# Altium schematic sheet DebugBreakout_RevD.SchDoc: Debug Breakout Board
size A3; Organization: INTERCREATE; Address1: 2415 3RD ST. SUITE #232; Address2: SAN FRANCISCO CA 94107; Revision: D; SheetNumber: 1; SheetTotal: 1; ProjectName: KAGWERKS COMMAND CENTER
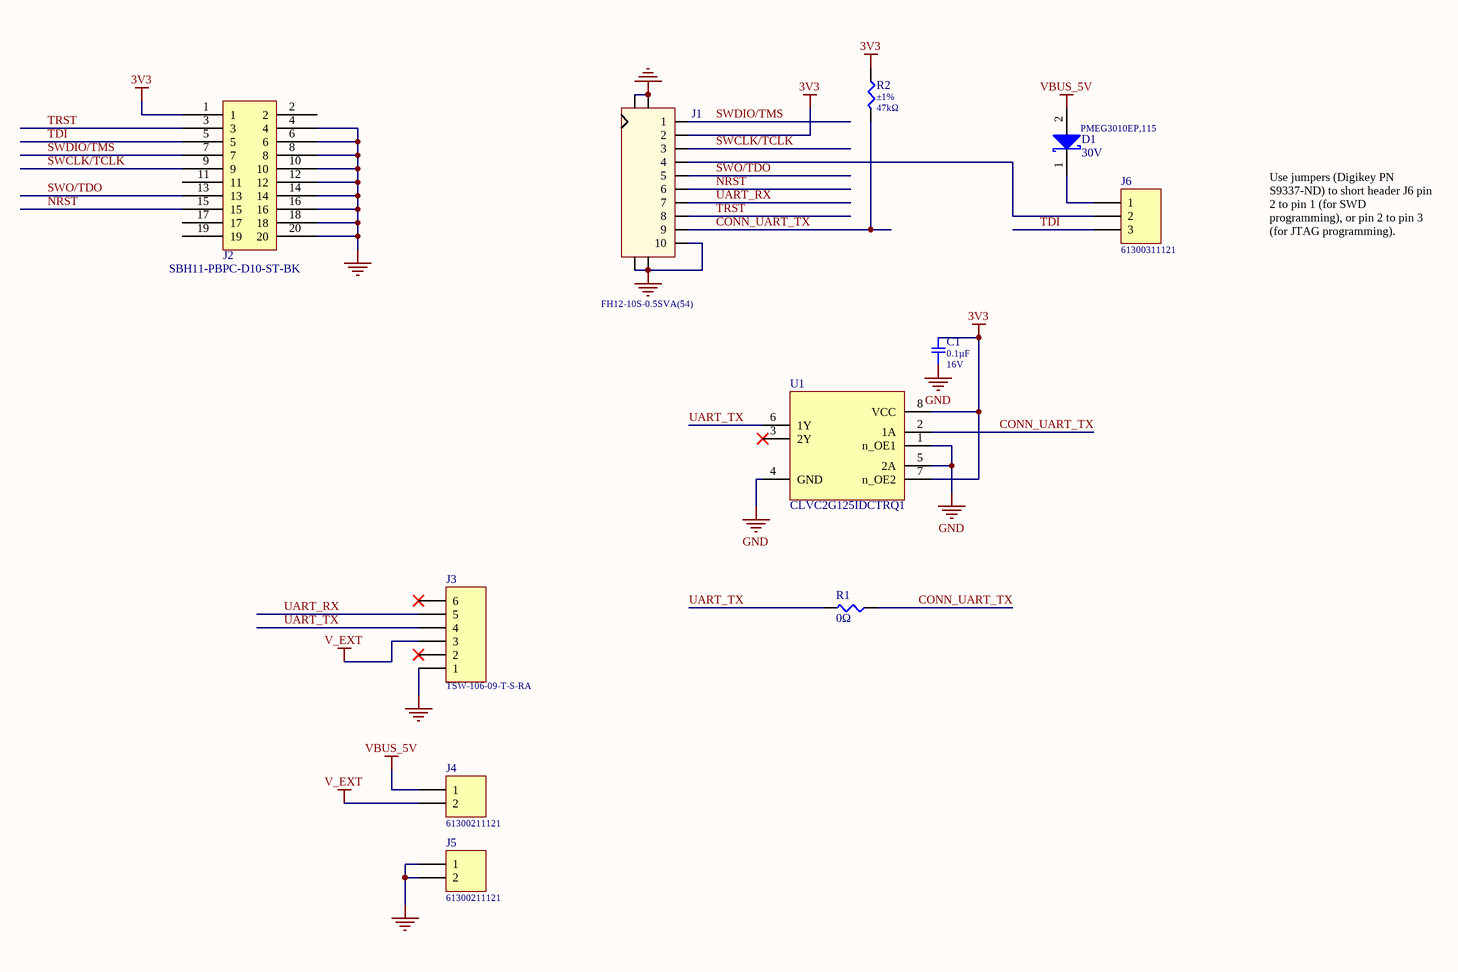
[diagram p0: DebugBreakout_RevD.SchDoc]

## Parts
C1  value 0.1µF  Voltage Rating: 16V  [CAP-0402]  (hidden comment: GRM155R71C104JA88D)
D1  PMEG3010EP,115  Reverse Voltage: 30V  [DIODE-SOD128]
J1  FH12-10S-0.5SVA(54)  [CONN-V-FPC-10P FH12-10S-0.5SVA(54)]
J2  SBH11-PBPC-D10-ST-BK  [HDR-V-2x10-KEYED]
J3  TSW-106-09-T-S-RA  [HDR-RA-1X6]
J4  61300211121  [HDR-V-1X2]
J5  61300211121  [HDR-V-1X2]
J6  61300311121  [HDR-V-1X3]
R1  value 0Ω  [RES-0402]  (hidden comment: RC0402FR-070RL)
R2  value 47kΩ  Tolerance: ±1%  [RES-0402]  (hidden comment: RC0402FR-0747KL)
U1  CLVC2G125IDCTRQ1  [IC-MSOP-8P]

## Nets
3V3: C1.2 J1.2 J2.1 R2.1 U1.7(n_OE2) U1.8(VCC)
GND: C1.1 J1.10 J1.ME1 J1.ME2 J1.ME3 J1.ME4 J2.4 J2.6 J2.8 J2.10 J2.12 J2.14 J2.16 J2.18 J2.20 J3.1 J5.1 J5.2 U1.1(n_OE1) U1.4(GND) U1.5(2A)
V_EXT: J3.3 J4.2
VBUS_5V: D1.2(A) J4.1
CONN_UART_TX: J1.9 R1.1 R2.2 U1.2(1A)
NRST: J1.6 J2.15
SWCLK/TCLK: J1.3 J2.9
SWDIO/TMS: J1.1 J2.7
SWO/TDO: J1.5 J2.13
TDI: J2.5 J6.3
TRST: J1.8 J2.3
UART_RX: J1.7 J3.5
UART_TX: J3.4 R1.2 U1.6(1Y)
NetD1_1: D1.1(K) J6.1
NetJ1_4: J1.4 J6.2

Not connected (* = marked no-connect by the designer): J2 2 11 17 19; J3 2* 6*; U1 3(2Y)*

## Notes on the sheet
- Use jumpers (Digikey PN S9337-ND) to short header J6 pin 2 to pin 1 (for SWD programming), or pin 2 to pin 3 (for JTAG programming).
- Title
- Size:
- Date:
- A3
- Number:
- Time:
- Revision:
- Sheet
- of
- File:

## Library data of the parts
C1 = CAP-0.1uF-16V-0402: CAP CER 0.1UF 16V X7R 0402 5%; Manufacturer: Murata; Capacitance: 100nF; Supplier 1: Digi-Key; MPN: GRM155R71C104JA88D; Stock 1: 100000; Pricing 1: 1=0.1, 10=0.051, 100=0.0225, 500=0.0161, 1000=0.01265, 2500=0.0115, 5000=0.01058 (USD); Mount: Surface Mount; Case/Package: 0402; Case Code (Metric): 1005; Case Code (Imperial): 0402; Min Operating Temperature: -55°C; Max Operating Temperature: 125°C; Package Quantity: 10000; Packaging: Tape and Reel; Dielectric: X7R; Termination: SMD/SMT; Voltage Rating (DC): 16V; Length: 1mm; Height: 0.5mm; Width: 0.02inch; Thickness: 0.022inch; Depth: 0.5mm; Radiation Hardening: No; REACH SVHC: No SVHC; Lead Free: Lead Free; ComponentLink1URL: http://www.mouser.com/ds/2/281/c02e-2905.pdf; ComponentLink1Description: http://www.mouser.com/ds/2/281/c02e-2905.pdf; ComponentLink2URL: http://www.murata.com/products/catalog/pdf/c02e.pdf; ComponentLink2Description: http://www.murata.com/products/catalog/pdf/c02e.pdf; ComponentLink3URL: http://search.murata.co.jp/Ceramy/image/img/A01X/G101/ENG/GRM155R71C104JA88-01.pdf; ComponentLink3Description: http://search.murata.co.jp/Ceramy/image/img/A01X/G101/ENG/GRM155R71C104JA88-01.pdf; Supplier Part Number 1: 490-6327-6-ND; Voltage: 16V; Manufacturer 1: Murata; Manufacturer Part Number 1: GRM155R71C104JA88D; Tolerance: ±5%
D1 = DIODE-SCHOTTKY-30V-1A-SOD128: DIODE SCHOTTKY 30V 1A SOD128; Manufacturer 1: Nexperia USA Inc.; Speed: Fast Recovery =< 500ns, > 200mA (Io); Capacitance @ Vr, F: 170pF @ 1V, 1MHz; Supplier 1: Digi-Key; Manufacturer Part Number 1: PMEG3010EP,115; RoHS: RoHS Compliant; Category: Discrete Semiconductor Products; Stock 1: 0; Pricing 1: 3000=0.11556, 6000=0.10856, 15000=0.10155, 30000=0.09338 (USD); Packaging: Tape & Reel (TR); Part Status: Active; Diode Type: Schottky; Current - Average Rectified (Io): 1A; Mounting Type: Surface Mount; Package / Case: SOD-128; Supplier Device Package: CFP5; Operating Temperature - Junction: 150°C (Max); Base Part Number: PMEG3010; ComponentLink1URL: https://assets.nexperia.com/documents/data-sheet/PMEG3010EP.pdf; ComponentLink1Description: https://assets.nexperia.com/documents/data-sheet/PMEG3010EP.pdf; Supplier Part Number 1: 1727-5408-1-ND
J1 = CONN-V-FPC-10P-0.5MM: CONN FFC VERT 10POS 0.50MM SMD; Manufacturer 1: Hirose; Actuator Material: Polyphenylene; Number of Positions: 10; Voltage Rating: 50V; Current Rating: 500mA; Gender: Receptacle; Wire/Cable Type: Straight; Mating Cycles: 20; Insulation Resistance: 500MR; Contact Resistance: 50mR; Pitch: 0.02inch; Supplier 1: Digi-Key; Manufacturer Part Number 1: FH12-10S-0.5SVA(54); Stock 1: 1442; Pricing 1: 1=1.18000, 10=1.03800, 25=0.97680, 50=0.93620, 100=0.89540, 250=0.81400, 500=0.73260 (USD); RoHS: Yes; Mount: Surface Mount; Contact Material: Bronze; Contact Plating: Gold; Housing Material: Nylon; Material: Nylon; Min Operating Temperature: -40°C; Max Operating Temperature: 85°C; Package Quantity: 1000; Packaging: Tape and Reel; Termination: Solder; Number of Rows: 1; REACH SVHC: Unknown; Flammability Rating: UL94 V-0; Lead Free: Lead Free; ComponentLink1URL: https://datasheet.ciiva.com/18554/fh12-18554796.pdf?src-supplier=Digi-Key; ComponentLink1Description: https://datasheet.ciiva.com/18554/fh12-18554796.pdf?src-supplier=Digi-Key; ComponentLink2URL: https://datasheet.ciiva.com/13702/ed-fh12-20140305-355586-13702565.pdf?src-supplier=Mouser; ComponentLink2Description: https://datasheet.ciiva.com/13702/ed-fh12-20140305-355586-13702565.pdf?src-supplier=Mouser; Supplier Part Number 1: H125134CT-ND
J2 = HDR-V-2x10-M: CONN HEADER VERT 20POS 2.54MM; Manufacturer 1: Sullins; Number of Positions: 20; Connector Type: Male Pin; Pitch: 0.1inch; Supplier 1: Digi-Key; Manufacturer Part Number 1: SBH11-PBPC-D10-ST-BK; Stock 1: 23438; Pricing 1: 1=0.54000, 10=0.51000, 100=0.39120, 500=0.34020, 1000=0.28067, 5000=0.24665, 10000=0.24570 (USD); RoHS: Yes; Mount: Through Hole; Color: Black; Contact Plating: Gold; Package Quantity: 1; Number of Rows: 2; Packaging: Tray; Termination: Solder; Row Spacing: 0.1inch; Lead Free: Lead Free; ComponentLink1URL: https://datasheet.ciiva.com/730/sbh11-pbpc-dxx-st-xx-730919.pdf?src-supplier=Digi-Key; ComponentLink1Description: https://datasheet.ciiva.com/730/sbh11-pbpc-dxx-st-xx-730919.pdf?src-supplier=Digi-Key; Supplier Part Number 1: S9172-ND
J3 = HDR-RA-1X6-M: Conn Unshrouded Header HDR 6 POS 2.54mm Solder RA Thru-Hole Automotive Bulk; Manufacturer 1: Samtec; Number of Contacts: 6; Gender: Male; Connector Type: Male Pin; Max Current Rating: 7.6A; Max Voltage Rating (AC): 450V; Supplier 1: Digi-Key; Manufacturer Part Number 1: TSW-106-09-T-S-RA; RoHS: Yes; Category: Headers and Wire Housings; Stock 1: 1097; Pricing 1: 1=0.46000, 10=0.43500, 100=0.33350, 500=0.29000, 1000=0.23925, 5000=0.21025, 10000=0.19575 (USD); Mount: Through Hole; Contact Plating: Tin; Contact Material: Bronze; Color: Black; Housing Color: Black; Housing Material: Polyester; Min Operating Temperature: -55°C; Max Operating Temperature: 105°C; Number of Rows: 1; Packaging: Bulk; Termination: Solder; Number of Positions: 6; Orientation: Right Angle; Length: 15.24mm; Pitch: 2.54mm; Depth: 9.9mm; Contact Mating Length: 0.23inch; Radiation Hardening: No; REACH SVHC: No SVHC; ComponentLink1URL: https://datasheet.ciiva.com/48560/htsw-th-48560268.pdf?src-supplier=Avnet; ComponentLink1Description: https://datasheet.ciiva.com/48560/htsw-th-48560268.pdf?src-supplier=Avnet; ComponentLink2URL: https://datasheet.ciiva.com/739/tsw-xxx-xx-xxx-x-xx-xxx-mkt-739950.pdf?src-supplier=Digi-Key; ComponentLink2Description: https://datasheet.ciiva.com/739/tsw-xxx-xx-xxx-x-xx-xxx-mkt-739950.pdf?src-supplier=Digi-Key; Supplier Part Number 1: SAM15949-ND
J4 J5 = HDR-V-1X2-M: Header, 2-Pin, 0.1"; Manufacturer: Wurth Electronics; Current Rating: 3A; Voltage Rating: 250V; Number of Positions: 2; Gender: Male; Connector Type: Male Pin; Pitch: 0.1inch; LatestRevisionDate: 17-Jul-2002; LatestRevisionNote: Re-released for DXP Platform.; Publisher: Altium Limited; Supplier 1: Digi-Key; MPN: 61300211121; Stock 1: 88010; Pricing 1: 1=0.13, 10=0.106, 25=0.088, 50=0.074, 100=0.067, 1000=0.061 (USD); Mount: Through Hole; Contact Plating: Gold; Housing Material: PBT; Contact Material: Copper,Copper Alloy; Colour: Black; Min Operating Temperature: -40°C; Max Operating Temperature: 125°C; Number of Rows: 1; Contact Gender: Male; Packaging: Bulk; Termination: Through Hole; Number of Contacts: 2; Contact Mating Length: 0.236inch; REACH SVHC: Unknown; Lead Free: Lead Free; ComponentLink1URL: https://datasheet.ciiva.com/13619/6130xx11121-48870-13619345.pdf; ComponentLink1Description: https://datasheet.ciiva.com/13619/6130xx11121-48870-13619345.pdf; Supplier Part Number 1: 732-5315-ND; Manufacturer 1: Wurth Electronics; Manufacturer Part Number 1: 61300211121
J6 = HDR-V-1X3-M: Header, 3-Pin, 0.1"; Manufacturer: Wurth Electronics; Number of Positions: 3; Gender: Male; Connector Type: Male Pin; Pitch: 0.1inch; LatestRevisionDate: 17-Jul-2002; LatestRevisionNote: Re-released for DXP Platform.; Publisher: Altium Limited; Supplier 1: Digi-Key; MPN: 61300311121; Stock 1: 41782; Pricing 1: 1=0.13, 10=0.106, 25=0.088, 50=0.074, 100=0.067, 1000=0.061 (USD); Mount: Through Hole; Contact Plating: Gold; Contact Material: Copper; Colour: Black; Number of Rows: 1; Packaging: Bulk; Termination: Solder; Number of Contacts: 3; Contact Mating Length: 0.236inch; REACH SVHC: Unknown; Lead Free: Lead Free; ComponentLink1URL: http://www.farnell.com/cad/1737268.pdf; ComponentLink1Description: http://www.farnell.com/cad/1737268.pdf; ComponentLink2URL: http://katalog.we-online.de/em/datasheet/6130xx11121.pdf; ComponentLink2Description: http://katalog.we-online.de/em/datasheet/6130xx11121.pdf; Supplier Part Number 1: 732-5316-ND; Manufacturer 1: Wurth Electronics; Manufacturer Part Number 1: 61300311121
R1 = RES-0-0402: RES 0 OHM JUMPER 1/16W 0402; Manufacturer: Yageo; Rated Power Dissipation (P): 62.5mW; Rated Temperature: 70°C; Resistance: 0R; Supplier 1: Digi-Key; Manufacturer Part Number: RC0402FR-070RL; RoHS: Yes; Category: Chip SMD Resistors; Stock 1: 2669862; Pricing 1: 10000=0.00132, 30000=0.00116, 50000=0.00109 (USD); Mount: Surface Mount; Number of Pins: 2; Package Shape: Rectangular; Size Code: 0402; Terminal Finish: Nickel; Min Operating Temperature: -55°C; Max Operating Temperature: 155°C; JESD-609 Code: e3; Resistor Type: FIXED RESISTOR; Packaging: Tape and Reel; Technology: METAL GLAZE/THICK FILM; Termination: Wraparound; REACH SVHC: Yes; RoHS Compliant: Yes; ComponentLink1URL: https://datasheet.ciiva.com:443/pdfs/VipMasterIC/IC/YAGO/YAGOS02562/YAGOS02562-1.pdf?src-supplier=IHS+Markit; ComponentLink1Description: https://datasheet.ciiva.com:443/pdfs/VipMasterIC/IC/YAGO/YAGOS02562/YAGOS02562-1.pdf?src-supplier=IHS+Markit; ComponentLink2URL: https://datasheet.ciiva.com/8896/pyu-rc0402-51-rohs-l-6-8896149.pdf?src-supplier=Avnet; ComponentLink2Description: https://datasheet.ciiva.com/8896/pyu-rc0402-51-rohs-l-6-8896149.pdf?src-supplier=Avnet; ComponentLink3URL: https://datasheet.ciiva.com/16790/pyu-rc0402-51-rohs-l-6-r-16790444.pdf?src-supplier=Future+Electronics; ComponentLink3Description: https://datasheet.ciiva.com/16790/pyu-rc0402-51-rohs-l-6-r-16790444.pdf?src-supplier=Future+Electronics; ComponentLink4URL: https://datasheet.ciiva.com/28419/pyu-rc0402-51-rohs-l-6-28419661.pdf?src-supplier=Avnet+Europe; ComponentLink4Description: https://datasheet.ciiva.com/28419/pyu-rc0402-51-rohs-l-6-28419661.pdf?src-supplier=Avnet+Europe; ComponentLink5URL: https://datasheet.ciiva.com/16869/pyu-rc0402-51-rohs-l-6-16869518.pdf?src-supplier=Avnet+Europe; ComponentLink5Description: https://datasheet.ciiva.com/16869/pyu-rc0402-51-rohs-l-6-16869518.pdf?src-supplier=Avnet+Europe; Manufacturer 1: Yageo; Manufacturer Part Number 1: RC0402FR-070RL; Supplier Part Number 1: 311-0.0LRTR-ND; Tolerance: Jumper; Manufacturer_PN: RC0402FR-070RL
R2 = RES-47K-0402: RES SMD 47K OHM 1% 1/16W 0402; Manufacturer 1: Yageo; Power Rating: 62.5mW; Temperature Coefficient: 100ppm/°C; Voltage Rating: 50V; Resistance: 47kR; Max Power Dissipation: 63mW; Supplier 1: Digi-Key; Manufacturer Part Number 1: RC0402FR-0747KL; Stock 1: 8667869; Pricing 1: 1=0.10000, 10=0.01600, 100=0.00640, 1000=0.00289, 2500=0.00251, 5000=0.00207 (USD); RoHS: Yes; Case/Package: 0402; Case Code (Imperial): 0402; Case Code (Metric): 1005; Min Operating Temperature: -55°C; Max Operating Temperature: 155°C; Packaging: Tape and Reel; Package Quantity: 1; Termination: SMD/SMT; Composition: Thick Film; Number of Terminations: 2; Military Standard: Not; Features: Moisture Resistant; Length: 1mm; Height: 0.016inch; Depth: 0.5mm; Width: 0.5mm; REACH SVHC: Unknown; Lead Free: Lead Free; ComponentLink1URL: https://datasheet.ciiva.com/16793/pyu-rc0402-51-rohs-l-6-r-16793430.pdf?src-supplier=Future+Electronics; ComponentLink1Description: https://datasheet.ciiva.com/16793/pyu-rc0402-51-rohs-l-6-r-16793430.pdf?src-supplier=Future+Electronics; ComponentLink2URL: https://datasheet.ciiva.com/46412/1018594-46412839.pdf?src-supplier=Element14; ComponentLink2Description: https://datasheet.ciiva.com/46412/1018594-46412839.pdf?src-supplier=Element14; ComponentLink3URL: https://datasheet.ciiva.com/15189/getdatasheetpartid-323748-15189466.pdf?src-supplier=Verical; ComponentLink3Description: https://datasheet.ciiva.com/15189/getdatasheetpartid-323748-15189466.pdf?src-supplier=Verical; ComponentLink4URL: https://datasheet.ciiva.com/2453/pyu-r-int-thick-7-2453388.pdf?src-supplier=Digi-Key; ComponentLink4Description: https://datasheet.ciiva.com/2453/pyu-r-int-thick-7-2453388.pdf?src-supplier=Digi-Key; ComponentLink5URL: https://datasheet.ciiva.com/2453/pyu-r-int-thick-7-2453389.pdf?src-supplier=Digi-Key; ComponentLink5Description: https://datasheet.ciiva.com/2453/pyu-r-int-thick-7-2453389.pdf?src-supplier=Digi-Key; ComponentLink6URL: https://datasheet.ciiva.com/2453/pyu-r-int-thick-7-2453390.pdf?src-supplier=Digi-Key; ComponentLink6Description: https://datasheet.ciiva.com/2453/pyu-r-int-thick-7-2453390.pdf?src-supplier=Digi-Key; Supplier Part Number 1: 311-47.0KLRCT-ND
U1 = IC-CLVC2G125I: 5.5 V SMT Dual Buffer Gate with 3-State Outputs - SM8; Manufacturer 1: Texas Instruments; Supplier 1: Digi-Key; Supplier Part Number 1: 296-30598-1-ND; Manufacturer Part Number 1: CLVC2G125IDCTRQ1; RoHS: No; Category: Buffers, Drivers and Transceivers